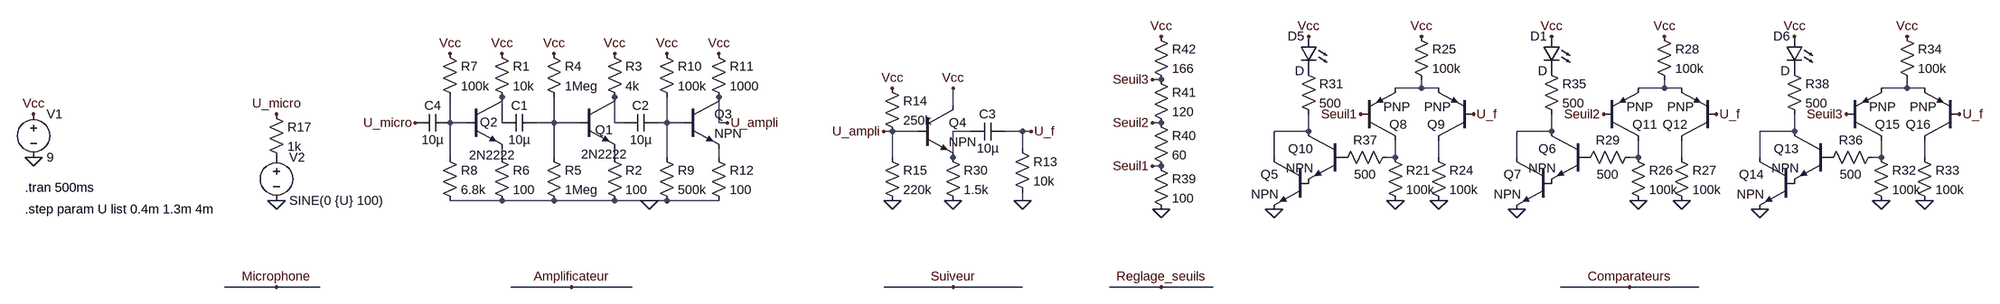
[diagram p0: schematic Sound-meter_theorical.asc]
Sound-meter_theorical.asc, the LTspice schematic file:
Version 4
SHEET 1 4624 692
WIRE 2000 32 1984 32
WIRE 2480 48 2480 32
WIRE 2480 48 2432 48
WIRE 2512 48 2480 48
WIRE 2928 48 2928 32
WIRE 2928 48 2880 48
WIRE 2960 48 2928 48
WIRE 3376 48 3376 32
WIRE 3376 48 3328 48
WIRE 3408 48 3376 48
WIRE 1616 80 1616 48
WIRE 688 112 688 64
WIRE 720 112 688 112
WIRE 784 112 784 64
WIRE 880 112 880 64
WIRE 880 112 848 112
WIRE 928 112 880 112
WIRE 992 112 992 64
WIRE 1008 112 992 112
WIRE 1088 112 1088 64
WIRE 1088 112 1072 112
WIRE 1120 112 1088 112
WIRE 1184 112 1184 64
WIRE 1200 112 1184 112
WIRE 2000 112 1984 112
WIRE 1504 128 1488 128
WIRE 1552 128 1504 128
WIRE 1648 128 1616 128
WIRE 1744 128 1712 128
WIRE 1760 128 1744 128
WIRE 2272 128 2272 96
WIRE 2272 128 2208 128
WIRE 2720 128 2720 96
WIRE 2720 128 2656 128
WIRE 3168 128 3168 96
WIRE 3168 128 3104 128
WIRE 1744 160 1744 128
WIRE 688 176 688 112
WIRE 784 176 784 160
WIRE 880 176 880 112
WIRE 992 176 992 160
WIRE 1088 176 1088 112
WIRE 1184 176 1184 160
WIRE 1504 176 1504 128
WIRE 1616 176 1616 128
WIRE 2208 176 2208 128
WIRE 2432 176 2432 144
WIRE 2432 176 2416 176
WIRE 2512 176 2512 144
WIRE 2656 176 2656 128
WIRE 2880 176 2880 144
WIRE 2880 176 2864 176
WIRE 2960 176 2960 144
WIRE 3104 176 3104 128
WIRE 3328 176 3328 144
WIRE 3328 176 3312 176
WIRE 3408 176 3408 144
WIRE 2000 192 1984 192
WIRE 784 256 688 256
WIRE 880 256 784 256
WIRE 992 256 880 256
WIRE 1056 256 992 256
WIRE 1088 256 1056 256
WIRE 1184 256 1088 256
WIRE 1744 256 1744 240
WIRE 368 416 272 416
WIRE 448 416 368 416
WIRE 912 416 800 416
WIRE 1024 416 912 416
WIRE 1616 416 1488 416
WIRE 1744 416 1616 416
WIRE 2000 416 1904 416
WIRE 2096 416 2000 416
WIRE 2864 416 2736 416
WIRE 2992 416 2864 416
FLAG -80 96 Vcc
FLAG -80 176 0
FLAG 688 -16 Vcc
FLAG 784 -16 Vcc
FLAG 992 -16 Vcc
FLAG 880 -16 Vcc
FLAG 1056 256 0
FLAG 1088 -16 Vcc
FLAG 1184 -16 Vcc
FLAG 368 256 0
FLAG 368 96 U_micro
FLAG 624 112 U_micro
FLAG 368 416 Microphone
FLAG 912 416 Amplificateur
FLAG 1616 416 Suiveur
FLAG 2864 416 Comparateurs
FLAG 1744 256 0
FLAG 1616 48 Vcc
FLAG 1504 48 Vcc
FLAG 1616 256 0
FLAG 1504 256 0
FLAG 1488 128 U_ampli
FLAG 2432 256 0
FLAG 2480 -48 Vcc
FLAG 2512 256 0
FLAG 2880 256 0
FLAG 2928 -48 Vcc
FLAG 2816 96 Seuil2
FLAG 2960 256 0
FLAG 3328 256 0
FLAG 3376 -48 Vcc
FLAG 3264 96 Seuil3
FLAG 3408 256 0
FLAG 2576 96 U_f
FLAG 2272 -48 Vcc
FLAG 2720 -48 Vcc
FLAG 3168 -48 Vcc
FLAG 3024 96 U_f
FLAG 3472 96 U_f
FLAG 2000 272 0
FLAG 2000 -48 Vcc
FLAG 2368 96 Seuil1
FLAG 1200 112 U_ampli
FLAG 1760 128 U_f
FLAG 2208 272 0
FLAG 2656 272 0
FLAG 3104 272 0
FLAG 1984 192 Seuil1
FLAG 1984 112 Seuil2
FLAG 1984 32 Seuil3
FLAG 2000 416 Reglage_seuils
SYMBOL voltage -80 80 R0
WINDOW 123 0 0 Left 0
WINDOW 39 0 0 Left 0
SYMATTR InstName V1
SYMATTR Value 9
SYMBOL res 768 -32 R0
SYMATTR InstName R1
SYMATTR Value 10k
SYMBOL cap 848 96 R90
WINDOW 0 0 32 VBottom 2
WINDOW 3 32 32 VTop 2
SYMATTR InstName C1
SYMATTR Value 10µ
SYMBOL cap 1072 96 R90
WINDOW 0 0 32 VBottom 2
WINDOW 3 32 32 VTop 2
SYMATTR InstName C2
SYMATTR Value 10µ
SYMBOL npn 928 64 R0
WINDOW 0 28 61 Left 2
WINDOW 3 2 106 Left 2
SYMATTR InstName Q1
SYMATTR Value 2N2222
SYMBOL res 976 160 R0
SYMATTR InstName R2
SYMATTR Value 100
SYMBOL res 976 -32 R0
SYMATTR InstName R3
SYMATTR Value 4k
SYMBOL res 864 -32 R0
SYMATTR InstName R4
SYMATTR Value 1Meg
SYMBOL res 864 160 R0
SYMATTR InstName R5
SYMATTR Value 1Meg
SYMBOL npn 720 64 R0
WINDOW 0 23 47 Left 2
WINDOW 3 3 108 Left 2
SYMATTR InstName Q2
SYMATTR Value 2N2222
SYMBOL res 768 160 R0
SYMATTR InstName R6
SYMATTR Value 100
SYMBOL res 672 -32 R0
SYMATTR InstName R7
SYMATTR Value 100k
SYMBOL res 672 160 R0
SYMATTR InstName R8
SYMATTR Value 6.8k
SYMBOL res 1072 160 R0
SYMATTR InstName R9
SYMATTR Value 500k
SYMBOL res 1072 -32 R0
SYMATTR InstName R10
SYMATTR Value 100k
SYMBOL npn 1120 64 R0
SYMATTR InstName Q3
SYMBOL res 1168 -32 R0
SYMATTR InstName R11
SYMATTR Value 1000
SYMBOL res 1168 160 R0
SYMATTR InstName R12
SYMATTR Value 100
SYMBOL cap 1712 112 R90
WINDOW 0 0 32 VBottom 2
WINDOW 3 32 32 VTop 2
SYMATTR InstName C3
SYMATTR Value 10µ
SYMBOL cap 688 96 R90
WINDOW 0 0 32 VBottom 2
WINDOW 3 32 32 VTop 2
SYMATTR InstName C4
SYMATTR Value 10µ
SYMBOL res 352 80 R0
SYMATTR InstName R17
SYMATTR Value 1k
SYMBOL voltage 368 160 R0
WINDOW 123 0 0 Left 0
WINDOW 39 0 0 Left 0
SYMATTR InstName V2
SYMATTR Value SINE(0 {U} 100)
SYMBOL res 1728 144 R0
SYMATTR InstName R13
SYMATTR Value 10k
SYMBOL res 1488 32 R0
SYMATTR InstName R14
SYMATTR Value 250k
SYMBOL res 1488 160 R0
SYMATTR InstName R15
SYMATTR Value 220k
SYMBOL res 1600 160 R0
SYMATTR InstName R30
SYMATTR Value 1.5k
SYMBOL npn 1552 80 R0
SYMATTR InstName Q4
SYMBOL pnp 2368 144 M180
WINDOW 0 53 29 Left 2
WINDOW 3 42 61 Left 2
SYMATTR InstName Q8
SYMBOL pnp 2576 144 R180
WINDOW 0 53 29 Left 2
WINDOW 3 42 61 Left 2
SYMATTR InstName Q9
SYMBOL res 2416 160 R0
SYMATTR InstName R21
SYMATTR Value 100k
SYMBOL res 2496 160 R0
SYMATTR InstName R24
SYMATTR Value 100k
SYMBOL res 2464 -64 R0
SYMATTR InstName R25
SYMATTR Value 100k
SYMBOL npn 2336 128 M0
SYMATTR InstName Q10
SYMBOL LED 2288 -48 M0
SYMATTR InstName D5
SYMBOL pnp 2816 144 M180
WINDOW 0 53 29 Left 2
WINDOW 3 42 61 Left 2
SYMATTR InstName Q11
SYMBOL pnp 3024 144 R180
WINDOW 0 53 29 Left 2
WINDOW 3 42 61 Left 2
SYMATTR InstName Q12
SYMBOL res 2864 160 R0
SYMATTR InstName R26
SYMATTR Value 100k
SYMBOL res 2944 160 R0
SYMATTR InstName R27
SYMATTR Value 100k
SYMBOL res 2912 -64 R0
SYMATTR InstName R28
SYMATTR Value 100k
SYMBOL res 2880 160 R90
WINDOW 0 0 56 VBottom 2
WINDOW 3 32 56 VTop 2
SYMATTR InstName R29
SYMATTR Value 500
SYMBOL pnp 3264 144 M180
WINDOW 0 53 29 Left 2
WINDOW 3 42 61 Left 2
SYMATTR InstName Q15
SYMBOL pnp 3472 144 R180
WINDOW 0 53 29 Left 2
WINDOW 3 42 61 Left 2
SYMATTR InstName Q16
SYMBOL res 3312 160 R0
SYMATTR InstName R32
SYMATTR Value 100k
SYMBOL res 3392 160 R0
SYMATTR InstName R33
SYMATTR Value 100k
SYMBOL res 3360 -64 R0
SYMATTR InstName R34
SYMATTR Value 100k
SYMBOL res 3328 160 R90
WINDOW 0 0 56 VBottom 2
WINDOW 3 32 56 VTop 2
SYMATTR InstName R36
SYMATTR Value 500
SYMBOL res 2432 160 R90
WINDOW 0 0 56 VBottom 2
WINDOW 3 32 56 VTop 2
SYMATTR InstName R37
SYMATTR Value 500
SYMBOL res 2256 0 R0
SYMATTR InstName R31
SYMATTR Value 500
SYMBOL LED 2736 -48 M0
SYMATTR InstName D1
SYMBOL res 2704 0 R0
SYMATTR InstName R35
SYMATTR Value 500
SYMBOL LED 3184 -48 M0
SYMATTR InstName D6
SYMBOL res 3152 0 R0
SYMATTR InstName R38
SYMATTR Value 500
SYMBOL res 1984 176 R0
SYMATTR InstName R39
SYMATTR Value 100
SYMBOL res 1984 96 R0
SYMATTR InstName R40
SYMATTR Value 60
SYMBOL res 1984 16 R0
SYMATTR InstName R41
SYMATTR Value 120
SYMBOL res 1984 -64 R0
SYMATTR InstName R42
SYMATTR Value 166
SYMBOL npn 2272 176 M0
SYMATTR InstName Q5
SYMBOL npn 2784 128 M0
SYMATTR InstName Q6
SYMBOL npn 2720 176 M0
SYMATTR InstName Q7
SYMBOL npn 3232 128 M0
SYMATTR InstName Q13
SYMBOL npn 3168 176 M0
SYMATTR InstName Q14
TEXT -96 232 Left 2 !.tran 500ms
TEXT -96 272 Left 2 !.step param U list 0.4m 1.3m 4m

The netlist it stands for:
* Sound-meter_theorical.asc
V1 Vcc 0 9
R1 Vcc N005 10k
C1 N006 N005 10µ
C2 N008 N007 10µ
Q1 N007 N006 N014 0 2N2222
R2 N014 0 100
R3 Vcc N007 4k
R4 Vcc N006 1Meg
R5 N006 0 1Meg
Q2 N005 N004 N013 0 2N2222
R6 N013 0 100
R7 Vcc N004 100k
R8 N004 0 6.8k
R9 N008 0 500k
R10 Vcc N008 100k
Q3 U_ampli N008 N015 0 NPN
R11 Vcc U_ampli 1000
R12 N015 0 100
C3 U_f N009 10µ
C4 N004 U_micro 10µ
R17 U_micro P001 1k
V2 P001 0 SINE(0 {U} 100)
R13 U_f 0 10k
R14 Vcc U_ampli 250k
R15 U_ampli 0 220k
R30 N009 0 1.5k
Q4 Vcc U_ampli N009 0 NPN
Q8 N016 Seuil1 N001 0 PNP
Q9 N017 U_f N001 0 PNP
R21 N016 0 100k
R24 N017 0 100k
R25 Vcc N001 100k
Q10 N010 P002 P003 0 NPN
D5 Vcc P004 D
Q11 N018 Seuil2 N002 0 PNP
Q12 N019 U_f N002 0 PNP
R26 N018 0 100k
R27 N019 0 100k
R28 Vcc N002 100k
R29 N018 P005 500
Q15 N020 Seuil3 N003 0 PNP
Q16 N021 U_f N003 0 PNP
R32 N020 0 100k
R33 N021 0 100k
R34 Vcc N003 100k
R36 N020 P006 500
R37 N016 P002 500
R31 P004 N010 500
D1 Vcc P007 D
R35 P007 N011 500
D6 Vcc P008 D
R38 P008 N012 500
R39 Seuil1 0 100
R40 Seuil2 Seuil1 60
R41 Seuil3 Seuil2 120
R42 Vcc Seuil3 166
Q5 N010 P003 0 0 NPN
Q6 N011 P005 P009 0 NPN
Q7 N011 P009 0 0 NPN
Q13 N012 P006 P010 0 NPN
Q14 N012 P010 0 0 NPN
.model D D
.lib standard.dio
.model NPN NPN
.model PNP PNP
.lib standard.bjt
.tran 500ms
.step param U list 0.4m 1.3m 4m
.backanno
.end